# Altium schematic sheet (5) Controller A20_SSRs.SchDoc
size 431 x 241 mm; SheetNumber: 5; SheetTotal: 6
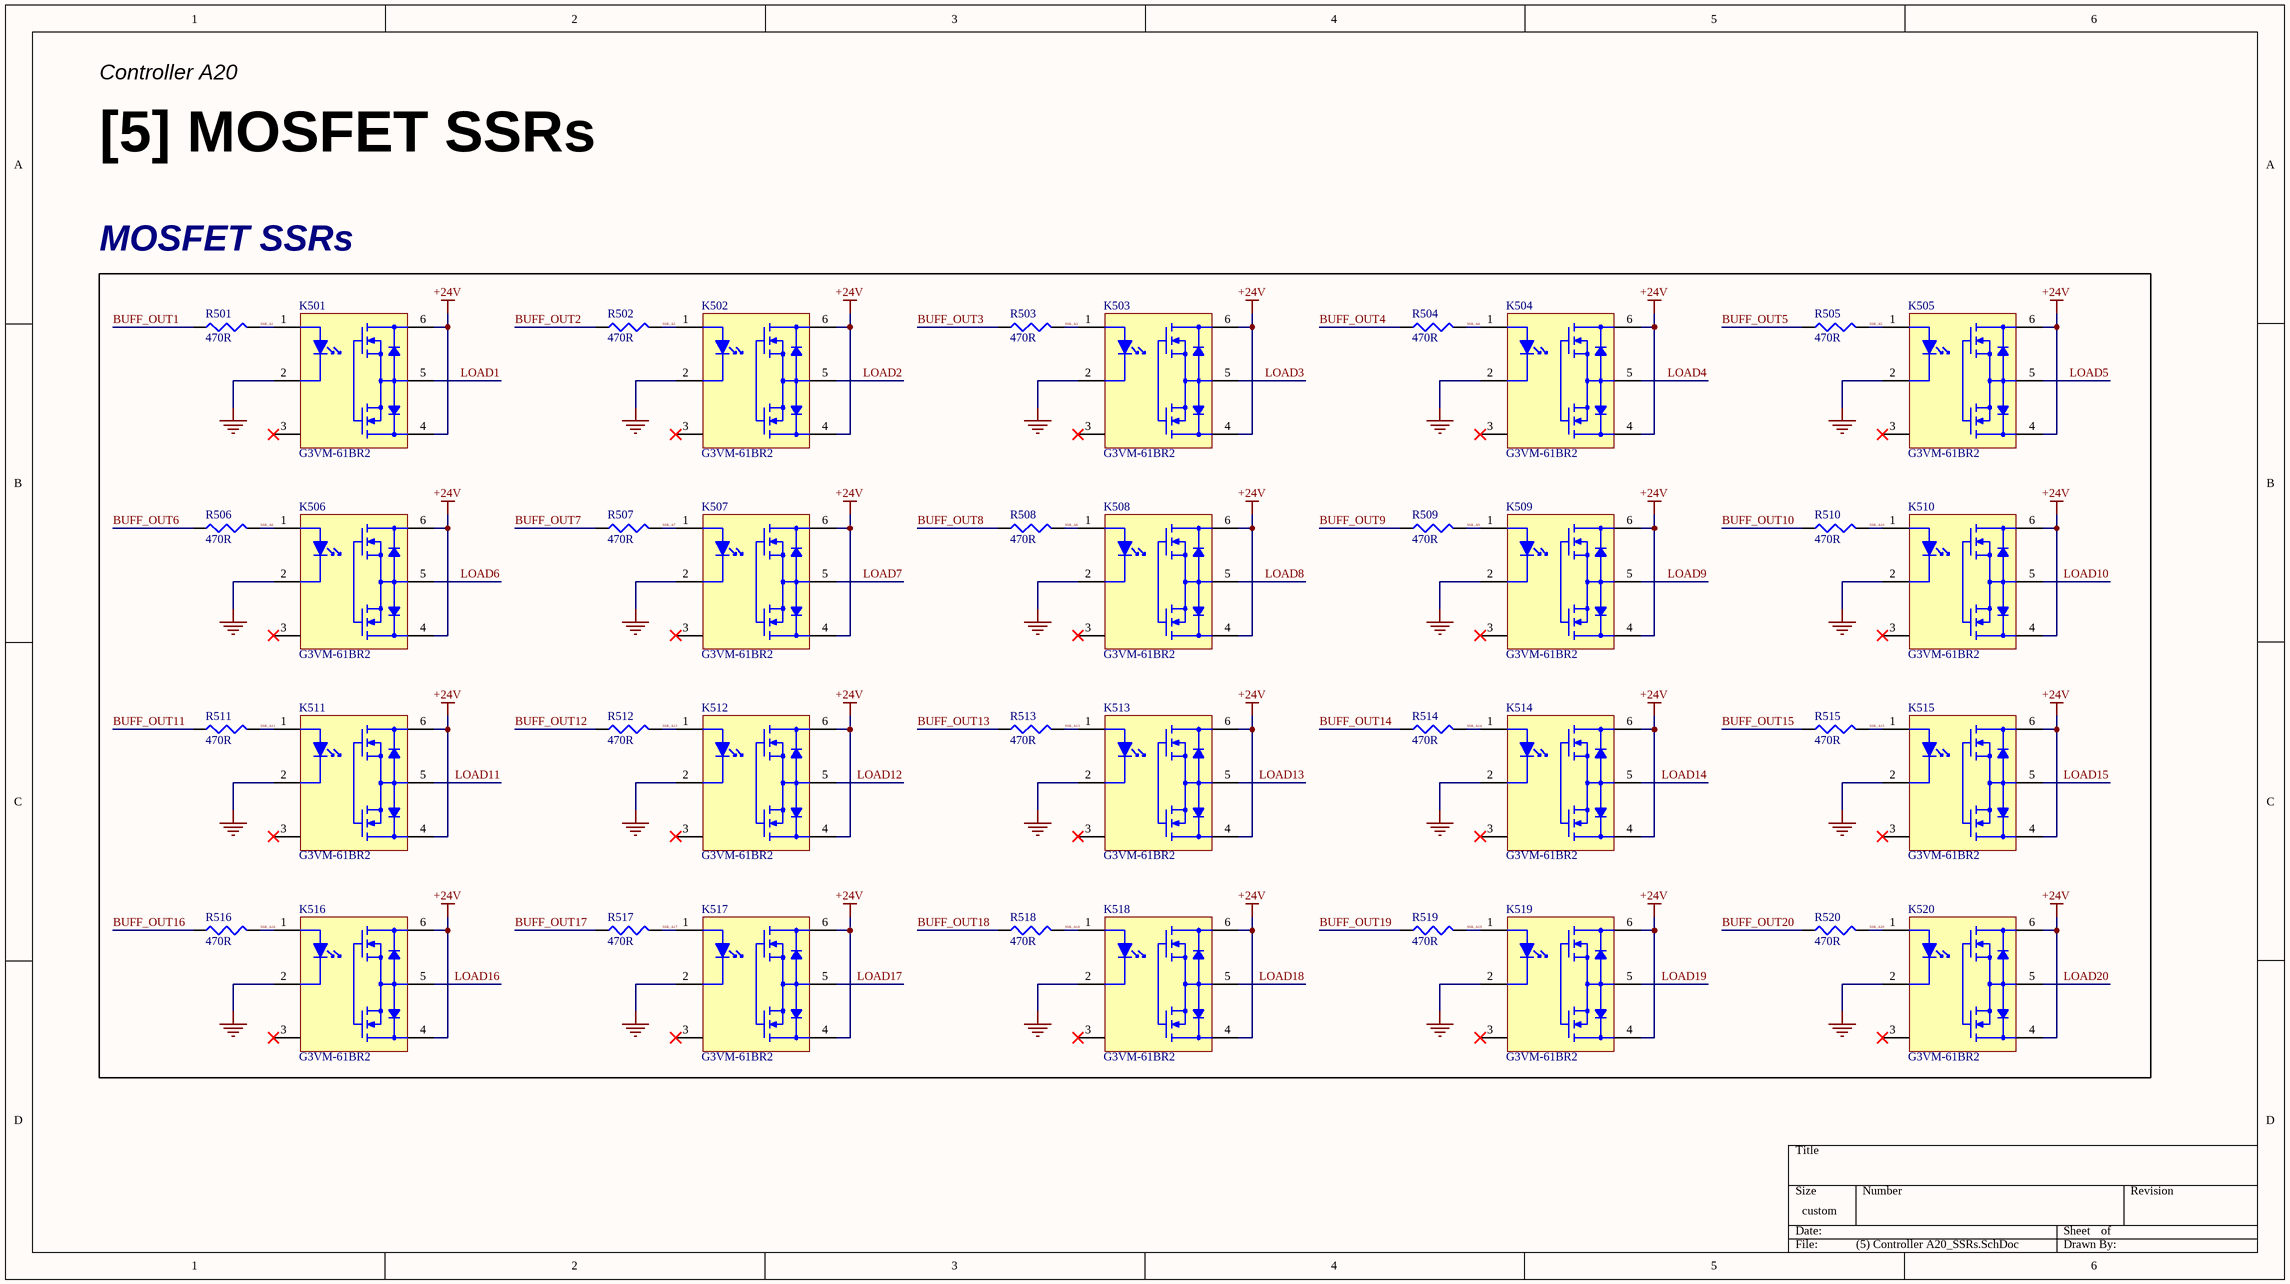
[diagram p0: (5) Controller A20_SSRs.SchDoc]

## Parts
K501  G3VM-61BR2  [DIP6]
K502  G3VM-61BR2  [DIP6]
K503  G3VM-61BR2  [DIP6]
K504  G3VM-61BR2  [DIP6]
K505  G3VM-61BR2  [DIP6]
K506  G3VM-61BR2  [DIP6]
K507  G3VM-61BR2  [DIP6]
K508  G3VM-61BR2  [DIP6]
K509  G3VM-61BR2  [DIP6]
K510  G3VM-61BR2  [DIP6]
K511  G3VM-61BR2  [DIP6]
K512  G3VM-61BR2  [DIP6]
K513  G3VM-61BR2  [DIP6]
K514  G3VM-61BR2  [DIP6]
K515  G3VM-61BR2  [DIP6]
K516  G3VM-61BR2  [DIP6]
K517  G3VM-61BR2  [DIP6]
K518  G3VM-61BR2  [DIP6]
K519  G3VM-61BR2  [DIP6]
K520  G3VM-61BR2  [DIP6]
R501  470R  [R0603]
R502  470R  [R0603]
R503  470R  [R0603]
R504  470R  [R0603]
R505  470R  [R0603]
R506  470R  [R0603]
R507  470R  [R0603]
R508  470R  [R0603]
R509  470R  [R0603]
R510  470R  [R0603]
R511  470R  [R0603]
R512  470R  [R0603]
R513  470R  [R0603]
R514  470R  [R0603]
R515  470R  [R0603]
R516  470R  [R0603]
R517  470R  [R0603]
R518  470R  [R0603]
R519  470R  [R0603]
R520  470R  [R0603]

## Blocks framed on the sheet
MOSFET SSRs: K501-K520 R501-R520

## Nets
+24V: K501.4 K501.6 K502.4 K502.6 K503.4 K503.6 K504.4 K504.6 K505.4 K505.6 K506.4 K506.6 K507.4 K507.6 K508.4 K508.6 K509.4 K509.6 K510.4 K510.6 K511.4 K511.6 K512.4 K512.6 K513.4 K513.6 K514.4 K514.6 K515.4 K515.6 K516.4 K516.6 K517.4 K517.6 K518.4 K518.6 K519.4 K519.6 K520.4 K520.6
GND: K501.2 K502.2 K503.2 K504.2 K505.2 K506.2 K507.2 K508.2 K509.2 K510.2 K511.2 K512.2 K513.2 K514.2 K515.2 K516.2 K517.2 K518.2 K519.2 K520.2
BUFF_OUT1: R501.1
BUFF_OUT2: R502.1
BUFF_OUT3: R503.1
BUFF_OUT4: R504.1
BUFF_OUT5: R505.1
BUFF_OUT6: R506.1
BUFF_OUT7: R507.1
BUFF_OUT8: R508.1
BUFF_OUT9: R509.1
BUFF_OUT10: R510.1
BUFF_OUT11: R511.1
BUFF_OUT12: R512.1
BUFF_OUT13: R513.1
BUFF_OUT14: R514.1
BUFF_OUT15: R515.1
BUFF_OUT16: R516.1
BUFF_OUT17: R517.1
BUFF_OUT18: R518.1
BUFF_OUT19: R519.1
BUFF_OUT20: R520.1
LOAD1: K501.5
LOAD2: K502.5
LOAD3: K503.5
LOAD4: K504.5
LOAD5: K505.5
LOAD6: K506.5
LOAD7: K507.5
LOAD8: K508.5
LOAD9: K509.5
LOAD10: K510.5
LOAD11: K511.5
LOAD12: K512.5
LOAD13: K513.5
LOAD14: K514.5
LOAD15: K515.5
LOAD16: K516.5
LOAD17: K517.5
LOAD18: K518.5
LOAD19: K519.5
LOAD20: K520.5
SSR_A1: K501.1 R501.2
SSR_A2: K502.1 R502.2
SSR_A3: K503.1 R503.2
SSR_A4: K504.1 R504.2
SSR_A5: K505.1 R505.2
SSR_A6: K506.1 R506.2
SSR_A7: K507.1 R507.2
SSR_A8: K508.1 R508.2
SSR_A9: K509.1 R509.2
SSR_A10: K510.1 R510.2
SSR_A11: K511.1 R511.2
SSR_A12: K512.1 R512.2
SSR_A13: K513.1 R513.2
SSR_A14: K514.1 R514.2
SSR_A15: K515.1 R515.2
SSR_A16: K516.1 R516.2
SSR_A17: K517.1 R517.2
SSR_A18: K518.1 R518.2
SSR_A19: K519.1 R519.2
SSR_A20: K520.1 R520.2

Not connected (* = marked no-connect by the designer): K501 3*; K502 3*; K503 3*; K504 3*; K505 3*; K506 3*; K507 3*; K508 3*; K509 3*; K510 3*; K511 3*; K512 3*; K513 3*; K514 3*; K515 3*; K516 3*; K517 3*; K518 3*; K519 3*; K520 3*

## Notes on the sheet
- Controller A20
- [5] MOSFET SSRs

## Library data of the parts
K501-K520 = G3VM-61BR2 60V 4/8 A SSR: 2.5kV 60V 1.64V DIP-6 Solid State Relays (SSR) RoHS; Manufacturer: Omron Electronics Inc-EMC Div; Qty.: 1; Ext. Price: 10.71; Mfr. Part #: G3VM-61BR2; Supplier: DigiKey; Supplier Part #: 39-G3VM-61BR2-ND; Package: DIP-6; Unit Price: 10.71; ComponentLink1Description: Datasheet; ComponentLink1URL: https://mm.digikey.com/Volume0/opasdata/d220001/medias/docus/311/G3VM-zBRzzzERzz_DS.pdf; ComponentLink2Description: Distributor Link; ComponentLink2URL: https://www.digikey.com/en/products/detail/omron-electronics-inc-emc-div/G3VM-61BR2/9920126?s=N4IgTCBcDaIOIGYBqBZAtANgIwCEBKEAugL5A
R501-R520 = RES 470R: 470 Ohms ±1% 0.1W, 1/10W Chip Resistor 0603 (1608 Metric) Thin Film; Manufacturer: YAGEO; Mfr. Part #: RT0603FRE07470RL; Qty.: 10; Ext. Price: 0.1; Supplier: DigiKey; Supplier Part #: YAG5742CT-ND; Package: 0603; Unit Price: 0.01; ComponentLink1Description: Datasheet; ComponentLink1URL: https://www.yageogroup.com/content/datasheet/asset/file/PYU-RT_1-TO-0-01_ROHS_L; ComponentLink2Description: Distributor Link; ComponentLink2URL: https://www.digikey.com/en/products/detail/yageo/RT0603FRE07470RL/1075383